# Altium schematic sheet HIVE_BOARD_DECAWAVE.SchDoc
size Tabloid; SheetNumber: 4; SheetTotal: 6; Sheet_Name: DECAWAVE; Size: 11x17
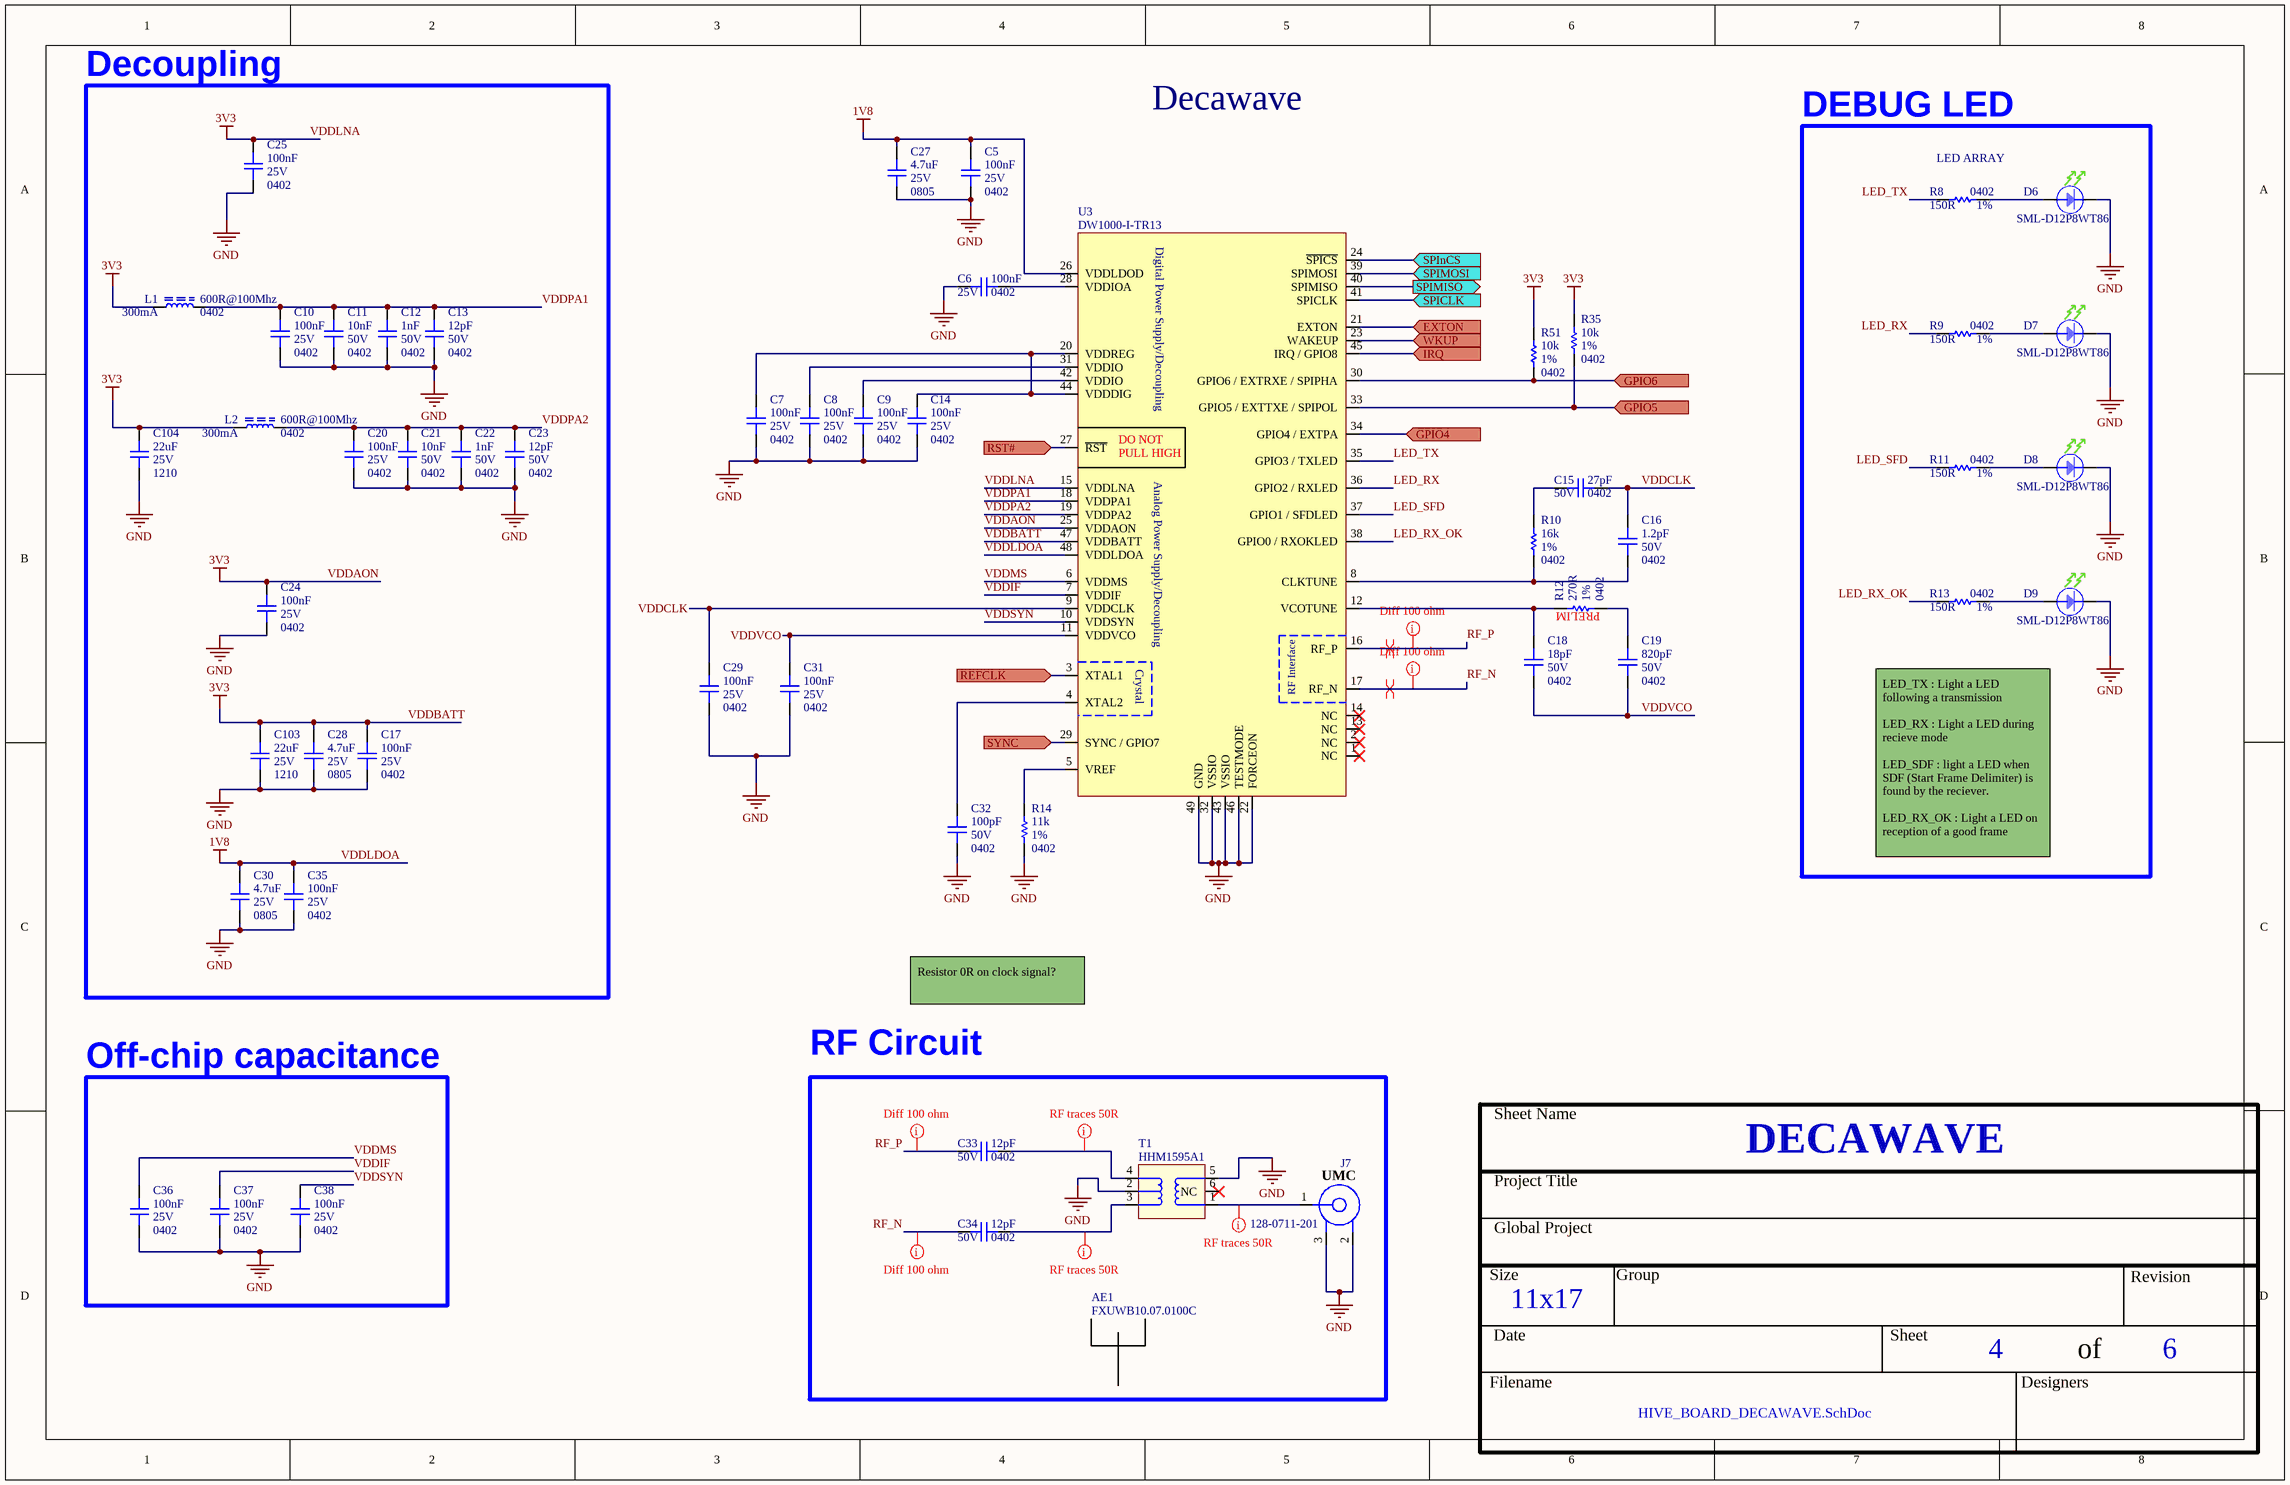
[diagram p0: HIVE_BOARD_DECAWAVE.SchDoc]

## Parts
AE1  FXUWB10.07.0100C  (mechanical)
C5  value 100nF  Package: 0402  Voltage Rating: 25V  [CAP_CER_0402]  (hidden comment: CGA2B3X7R1E104K050BB)
C6  value 100nF  Package: 0402  Voltage Rating: 25V  [CAP_CER_0402]  (hidden comment: CGA2B3X7R1E104K050BB)
C7  value 100nF  Package: 0402  Voltage Rating: 25V  [CAP_CER_0402]  (hidden comment: CGA2B3X7R1E104K050BB)
C8  value 100nF  Package: 0402  Voltage Rating: 25V  [CAP_CER_0402]  (hidden comment: CGA2B3X7R1E104K050BB)
C9  value 100nF  Package: 0402  Voltage Rating: 25V  [CAP_CER_0402]  (hidden comment: CGA2B3X7R1E104K050BB)
C10  value 100nF  Package: 0402  Voltage Rating: 25V  [CAP_CER_0402]  (hidden comment: CGA2B3X7R1E104K050BB)
C11  value 10nF  Package: 0402  Voltage Rating: 50V  [CAP_CER_0402]  (hidden comment: CL05B103KB5NFNC)
C12  value 1nF  Package: 0402  Voltage Rating: 50V  [CAP_CER_0402]  (hidden comment: CC0402KRX7R9BB102)
C13  value 12pF  Package: 0402  Voltage Rating: 50V  [CAP_CER_0402]  (hidden comment: CC0402JRNPO9BN120)
C14  value 100nF  Package: 0402  Voltage Rating: 25V  [CAP_CER_0402]  (hidden comment: CGA2B3X7R1E104K050BB)
C15  value 27pF  Package: 0402  Voltage Rating: 50V  [CAP_CER_0402]  (hidden comment: CC0402JRNPO9BN270)
C16  value 1.2pF  Package: 0402  Voltage Rating: 50V  [CAP_CER_0402]  (hidden comment: C0402C129C5GACTU)
C17  value 100nF  Package: 0402  Voltage Rating: 25V  [CAP_CER_0402]  (hidden comment: CGA2B3X7R1E104K050BB)
C18  value 18pF  Package: 0402  Voltage Rating: 50V  [CAP_CER_0402]  (hidden comment: GRM1555C1H180GA01D)
C19  value 820pF  Package: 0402  Voltage Rating: 50V  [CAP_CER_0402]  (hidden comment: CC0402KRX7R9BB821)
C20  value 100nF  Package: 0402  Voltage Rating: 25V  [CAP_CER_0402]  (hidden comment: CGA2B3X7R1E104K050BB)
C21  value 10nF  Package: 0402  Voltage Rating: 50V  [CAP_CER_0402]  (hidden comment: CL05B103KB5NFNC)
C22  value 1nF  Package: 0402  Voltage Rating: 50V  [CAP_CER_0402]  (hidden comment: CC0402KRX7R9BB102)
C23  value 12pF  Package: 0402  Voltage Rating: 50V  [CAP_CER_0402]  (hidden comment: CC0402JRNPO9BN120)
C24  value 100nF  Package: 0402  Voltage Rating: 25V  [CAP_CER_0402]  (hidden comment: CGA2B3X7R1E104K050BB)
C25  value 100nF  Package: 0402  Voltage Rating: 25V  [CAP_CER_0402]  (hidden comment: CGA2B3X7R1E104K050BB)
C27  value 4.7uF  Package: 0805  Voltage Rating: 25V  [CAP_CER_0805]  (hidden comment: C2012X7R1E475K125AE)
C28  value 4.7uF  Package: 0805  Voltage Rating: 25V  [CAP_CER_0805]  (hidden comment: C2012X7R1E475K125AE)
C29  value 100nF  Package: 0402  Voltage Rating: 25V  [CAP_CER_0402]  (hidden comment: CGA2B3X7R1E104K050BB)
C30  value 4.7uF  Package: 0805  Voltage Rating: 25V  [CAP_CER_0805]  (hidden comment: C2012X7R1E475K125AE)
C31  value 100nF  Package: 0402  Voltage Rating: 25V  [CAP_CER_0402]  (hidden comment: CGA2B3X7R1E104K050BB)
C32  value 100pF  Package: 0402  Voltage Rating: 50V  [CAP_CER_0402]  (hidden comment: CC0402JRNPO9BN101)
C33  value 12pF  Package: 0402  Voltage Rating: 50V  [CAP_CER_0402]  (hidden comment: CC0402JRNPO9BN120)
C34  value 12pF  Package: 0402  Voltage Rating: 50V  [CAP_CER_0402]  (hidden comment: CC0402JRNPO9BN120)
C35  value 100nF  Package: 0402  Voltage Rating: 25V  [CAP_CER_0402]  (hidden comment: CGA2B3X7R1E104K050BB)
C36  value 100nF  Package: 0402  Voltage Rating: 25V  [CAP_CER_0402]  (hidden comment: CGA2B3X7R1E104K050BB)
C37  value 100nF  Package: 0402  Voltage Rating: 25V  [CAP_CER_0402]  (hidden comment: CGA2B3X7R1E104K050BB)
C38  value 100nF  Package: 0402  Voltage Rating: 25V  [CAP_CER_0402]  (hidden comment: CGA2B3X7R1E104K050BB)
C103  value 22uF  Package: 1210  Voltage Rating: 25V  [CAP_CER_1210]  (hidden comment: C3225X7R1E226M250AB)
C104  value 22uF  Package: 1210  Voltage Rating: 25V  [CAP_CER_1210]  (hidden comment: C3225X7R1E226M250AB)
D6  SML-D12P8WT86  [LED_SML-D12P8WT86]
D7  SML-D12P8WT86  [LED_SML-D12P8WT86]
D8  SML-D12P8WT86  [LED_SML-D12P8WT86]
D9  SML-D12P8WT86  [LED_SML-D12P8WT86]
J7  128-0711-201  [CON_UMC_128-0711-201]
L1  value 600R@100Mhz  Current Rating: 300mA  Package: 0402  [FER_0402]  (hidden comment: BLM15AG601SN1D)
L2  value 600R@100Mhz  Current Rating: 300mA  Package: 0402  [FER_0402]  (hidden comment: BLM15AG601SN1D)
R8  value 150R  Tolerance: 1%  Package: 0402  [RES_0402]  (hidden comment: RC0402FR-07150RL)
R9  value 150R  Tolerance: 1%  Package: 0402  [RES_0402]  (hidden comment: RC0402FR-07150RL)
R10  value 16k  Tolerance: 1%  Package: 0402  [RES_0402]  (hidden comment: RC0402FR-0716KL)
R11  value 150R  Tolerance: 1%  Package: 0402  [RES_0402]  (hidden comment: RC0402FR-07150RL)
R12  value 270R  Tolerance: 1%  Package: 0402  [RES_0402]  (hidden comment: RC0402FR-07270RL)
R13  value 150R  Tolerance: 1%  Package: 0402  [RES_0402]  (hidden comment: RC0402FR-07150RL)
R14  value 11k  Tolerance: 1%  Package: 0402  [RES_0402]  (hidden comment: RC0402FR-0711KL)
R35  value 10k  Tolerance: 1%  Package: 0402  [RES_0402]  (hidden comment: RC0402FR-0710KP)
R51  value 10k  Tolerance: 1%  Package: 0402  [RES_0402]  (hidden comment: RC0402FR-0710KP)
T1  HHM1595A1  [XFR_HHM1595A1]
U3  DW1000-I-TR13  [COM_XCV_DW1000-I-TR13]

## Blocks framed on the sheet
Decoupling: C10-C13 C17 C20-C25 C28 C30 C35 C103 C104 L1 L2
DEBUG LED: D6-D9 R8 R9 R11 R13
Off-chip capacitance: C36-C38
RF Circuit: AE1 C33 C34 J7 T1

## Ports
EXTON (in), GPIO4 (in), GPIO5 (in), GPIO6 (in), IRQ (in), REFCLK (in), RST# (in), SPICLK (in), SPIMISO (out), SPIMOSI (in), SPInCS (in), SYNC (in), WKUP (in)

## Nets
GND: C5.1 C6.2 C7.1 C8.1 C9.1 C10.1 C11.1 C12.1 C13.1 C14.1 C17.1 C20.1 C21.1 C22.1 C23.1 C24.1 C25.1 C27.1 C28.1 C29.1 C30.1 C31.1 C32.1 C35.1 C36.1 C37.1 C38.1 C103.1 C104.1 D6.K D7.K D8.K D9.K J7.2 J7.3 R14.1 T1.2(GND) T1.5 U3.22(FORCEON) U3.32(VSSIO) U3.43(VSSIO) U3.46(TESTMODE) U3.49(GND)
VDDAON: C17.2 C24.2 C25.2 C28.2 C103.2 C104.2 L1.1 L2.1 R35.2 R51.2 U3.15(VDDLNA) U3.25(VDDAON) U3.47(VDDBATT)  [also labelled 3V3, VDDBATT, VDDLNA]
VDDLDOA: C5.2 C27.2 C30.2 C35.2 U3.26(VDDLDOD) U3.48(VDDLDOA)  [also labelled 1V8]
EXTON: U3.21(EXTON) ; port EXTON
GPIO4: U3.34(GPIO4_/_EXTPA) ; port GPIO4
GPIO5: R35.1 U3.33(GPIO5_/_EXTTXE_/_SPIPOL) ; port GPIO5
GPIO6: R51.1 U3.30(GPIO6_/_EXTRXE_/_SPIPHA) ; port GPIO6
IRQ: U3.45(IRQ_/_GPIO8) ; port IRQ
LED_RX: R9.2 U3.36(GPIO2_/_RXLED)
LED_RX_OK: R13.2 U3.38(GPIO0_/_RXOKLED)
LED_SFD: R11.2 U3.37(GPIO1_/_SFDLED)
LED_TX: R8.2 U3.35(GPIO3_/_TXLED)
REFCLK: U3.3(XTAL1) ; port REFCLK
RF_N: C34.2 U3.17(RF_N)
RF_P: C33.2 U3.16(RF_P)
RST#: U3.27(~{RST}) ; port RST#
SPICLK: U3.41(SPICLK) ; port SPICLK
SPIMISO: U3.40(SPIMISO) ; port SPIMISO
SPIMOSI: U3.39(SPIMOSI) ; port SPIMOSI
SPInCS: U3.24(~{SPICS}) ; port SPInCS
SYNC: U3.29(SYNC_/_GPIO7) ; port SYNC
VDDCLK: C15.1 C16.2 C29.2 U3.9(VDDCLK)
VDDIF: C37.2 U3.7(VDDIF)
VDDMS: C36.2 U3.6(VDDMS)
VDDPA1: C10.2 C11.2 C12.2 C13.2 L1.2 U3.18(VDDPA1)
VDDPA2: C20.2 C21.2 C22.2 C23.2 L2.2 U3.19(VDDPA2)
VDDSYN: C38.2 U3.10(VDDSYN)
VDDVCO: C18.1 C19.1 C31.2 U3.11(VDDVCO)
WKUP: U3.23(WAKEUP) ; port WKUP
NetC6_1: C6.1 U3.28(VDDIOA)
NetC7_2: C7.2 C14.2 U3.20(VDDREG) U3.44(VDDDIG)
NetC8_2: C8.2 U3.31(VDDIO)
NetC9_2: C9.2 U3.42(VDDIO)
NetC15_2: C15.2 R10.2
NetC16_1: C16.1 R10.1 U3.8(CLKTUNE)
NetC18_2: C18.2 R12.2 U3.12(VCOTUNE)
NetC19_2: C19.2 R12.1
NetC32_2: C32.2 U3.4(XTAL2)
NetC33_1: C33.1 T1.4
NetC34_1: C34.1 T1.3
NetD6_A: D6.A R8.1
NetD7_A: D7.A R9.1
NetD8_A: D8.A R11.1
NetD9_A: D9.A R13.1
NetJ7_1: J7.1 T1.1
NetR14_2: R14.2 U3.5(VREF)

Not connected (* = marked no-connect by the designer): T1 6(NC)*; U3 1(NC)* 2(NC)* 13(NC)* 14(NC)*

## Layout directives
mark named RF traces 50R: NetC33_1, NetC34_1, NetJ7_1
mark named Diff 100 ohm: RF_N, RF_P
differential pair: RF_N, RF_P

## Notes on the sheet
- Decawave
- (near R8) LED ARRAY
- LED_TX : Light a LED following a transmission
  LED_RX : Light a LED during recieve mode
  LED_SDF : light a LED when SDF (Start Frame Delimiter) is found by the reciever.
  LED_RX_OK : Light a LED on reception of a good frame
- Resistor 0R on clock signal?
- Sheet Name
- Project Title
- Global Project
- Size
- Group
- Revision
- Date
- Sheet
- of
- Filename
- Designers
- (in symbol COM_XCV_DW1000-I-TR13) Digital Power Supply/Decoupling; DO NOT; PULL HIGH; Analog Power Supply/Decoupling; Crystal; RF Interface
- (in symbol CON_UMC_128-0711-201) UMC
- (in symbol RES_RC0402FR-07270RL) PRELIM

## Library data of the parts
AE1 = ANT_FXUWB10.07.0100C: External antenna - UWB - UMCC plug; Value: 3.0-10.3GHz; GRAMS Lib Spec: 2.8; HelpURL: http://cdn.taoglas.com/datasheets/FXUWB10.07.0100C.pdf; CreatedBy/Date: Philippe Arsenault; Temperature: -40°C to 85°C; Package: 50 ohm; Assembly Type: UMCC plug; Part Number #1: FXUWB10.07.0100C; Supplier 1: Digi-Key; Supplier Part Number 1: 931-1523-ND
C5-C10 C14 C17 C20 C24 C25 C29 C31 C35-C38 = CAP_CER_CGA2B3X7R1E104K050BB: CAP - CER 0.1µF 10% 25V X7R - 0402; Manufacturer #1: TDK Corporation; GRAMS Lib Spec: 2.8; Magnetic Material: Unknown; Polarized: NO; Assembly Type: SMD; CreatedBy/Date: Nicolas Roy 2018-11-07; Current Rating: *; HelpURL: https://product.tdk.com/info/en/catalog/datasheets/mlcc_automotive_general_en.pdf; Manufacturer #2: *; Note: *; Part Number #1: CGA2B3X7R1E104K050BB; Part Number #2: *; Power Max: *; Temperature: -55°C ~ 125°C; Tolerance: 10%; VerifiedBy: Nicolas V. (2019-01-22); Supplier 1: Digi-Key; Supplier Part Number 1: 445-6902-1-ND; Cryo: UNKNOWN
C11 C21 = CAP_CER_CL05B103KB5NFNC: CAP - CER 10nF ±10% 50V X7R - 0402; Manufacturer #1: Samsung Electro-Mechanics; GRAMS Lib Spec: 2.8; Magnetic Material: Unknown; Polarized: No; Assembly Type: SMD; CreatedBy/Date: Keven Deslandes - 2018/11/20; Current Rating: *; HelpURL: http://www.samsungsem.com/kr/support/product-search/mlcc/CL05B103KB5NFNC.jsp; Manufacturer #2: *; Note: *; Part Number #1: CL05B103KB5NFNC; Part Number #2: *; Power Max: *; Temperature: -55°C ~ 125°C; Tolerance: 10%; VerifiedBy: Nicolas Roy - 2018/12/11; Supplier 1: Digi-Key; Supplier Part Number 1: 1276-1499-1-ND; Cryo: UNKNOWN
C12 C22 = CAP_CER_CC0402KRX7R9BB102: CAP - CER 1nF 10% 50V X7R - 0402; Manufacturer #1: Yageo; GRAMS Lib Spec: 2.8; Magnetic Material: UNKNOWN; Polarized: NO; Assembly Type: SMD; CreatedBy/Date: Jonathan Bouchard 2019-04-06; Current Rating: *; HelpURL: http://www.yageo.com/documents/recent/UPY-GPHC_X7R_6.3V-to-50V_18.pdf; Manufacturer #2: *; Note: *; Part Number #1: CC0402KRX7R9BB102; Part Number #2: *; Power Max: *; Temperature: -55°C ~ 125°C; Tolerance: 10%; VerifiedBy: Nicolas V. (2019-04-30); Supplier 1: Digi-Key; Supplier Part Number 1: 311-1036-1-ND; Cryo: UNKNOWN
C13 C23 C33 C34 = CAP_CER_CC0402JRNPO9BN120: CAP - CER 12pF 50V ±5% C0G, NP0 - 0402; Manufacturer #1: Yageo; GRAMS Lib Spec: 2.8; Magnetic Material: Unknown; Polarized: NO; Assembly Type: SMD; CreatedBy/Date: Philippe Arsenault/ 2020-07-24; Current Rating: *; HelpURL: https://www.yageo.com/upload/media/product/productsearch/datasheet/mlcc/UPY-GP_NP0_16V-to-50V_18.pdf; Manufacturer #2: *; Note: *; Part Number #1: CC0402JRNPO9BN120; Part Number #2: *; Power Max: *; Temperature: -55°C ~ 125°C; Tolerance: ±5%; VerifiedBy: Louis-Daniel Gaulin / 2020-07-29; Cryo: UNKNOWN; Supplier 1: Digi-Key; Supplier Part Number 1: 311-1016-1-ND
C15 = CAP_CER_CC0402JRNPO9BN270: CAP - CER 27pF 50V ±5% C0G, NP0 - 0402; Manufacturer #1: Yageo; GRAMS Lib Spec: 2.8; Magnetic Material: Unknown; Polarized: NO; Assembly Type: SMD; CreatedBy/Date: Philippe Arsenault/ 2020-07-24; Current Rating: *; HelpURL: https://www.yageo.com/upload/media/product/productsearch/datasheet/mlcc/UPY-GP_NP0_16V-to-50V_18.pdf; Manufacturer #2: *; Note: *; Part Number #1: CC0402JRNPO9BN270; Part Number #2: *; Power Max: *; Temperature: -55°C ~ 125°C; Tolerance: ±5%; VerifiedBy: Louis-Daniel Gaulin / 2020-07-29; Cryo: UNKNOWN; Supplier 1: Digi-Key; Supplier Part Number 1: 311-1019-1-ND
C16 = CAP_CER_C0402C129C5GACTU: CAP - CER 1.2pF 50V ±0.25pF C0G, NP0 - 0402; Manufacturer #1: KEMET; GRAMS Lib Spec: 2.8; Magnetic Material: Unknown; Polarized: NO; Assembly Type: SMD; CreatedBy/Date: Philippe Arsenault/ 2020-07-24; Current Rating: *; HelpURL: https://content.kemet.com/datasheets/KEM_C1003_C0G_SMD.pdf; Manufacturer #2: *; Note: *; Part Number #1: C0402C129C5GACTU; Part Number #2: *; Power Max: *; Temperature: -55°C ~ 125°C; Tolerance: ±0.25pF; VerifiedBy: Louis-Daniel Gaulin / 2020-07-29; Cryo: UNKNOWN; Supplier 1: Digi-Key; Supplier Part Number 1: 399-1001-1-ND
C18 = CAP_CER_GRM1555C1H180GA01D: CAP - CER 18pF 50V C0G, NPO - 0402; Manufacturer #1: Murata Electronics North America; Tolerance: 2%; GRAMS Lib Spec: 2.8; Note: Not for new Design; Magnetic Material: UNKNOWN; Polarized: NO; Current Rating: *; Power Max: *; HelpURL: https://psearch.en.murata.com/capacitor/product/GRM1555C1H180GA01%23.html; CreatedBy/Date: Tommy Rossignol / 2018-11-20; VerifiedBy: Caroline Paulin - 13 fév 2019; Temperature: -55°C ~ 125°C; Manufacturer #2: *; Assembly Type: SMD; Part Number #2: *; Part Number #1: GRM1555C1H180GA01D; Supplier 1: Digi-Key; Supplier Part Number 1: 490-6204-1-ND; Cryo: UNKNOWN
C19 = CAP_CER_CC0402KRX7R9BB821: CAP - CER 820pF 50V ±10% X7R - 0402; Manufacturer #1: Yageo; GRAMS Lib Spec: 2.8; Magnetic Material: Unknown; Polarized: NO; Assembly Type: SMD; CreatedBy/Date: Philippe Arsenault/ 2020-07-24; Current Rating: *; HelpURL: https://www.yageo.com/upload/media/product/productsearch/datasheet/mlcc/UPY-GPHC_X7R_6.3V-to-50V_18.pdf; Manufacturer #2: *; Note: *; Part Number #1: CC0402KRX7R9BB821; Part Number #2: *; Power Max: *; Temperature: -55°C ~ 125°C; Tolerance: ±10%; VerifiedBy: Louis-Daniel Gaulin / 2020-07-29; Cryo: UNKNOWN; Supplier 1: Digi-Key; Supplier Part Number 1: 311-1727-1-ND
C27 C28 C30 = CAP_CER_C2012X7R1E475K125AE: CAP - CER 4.7UF 10% 25V X7R - 0805; Manufacturer #1: TDK Corporation; GRAMS Lib Spec: 2.8; Magnetic Material: Unknown; Polarized: No; Tolerance: 10%; Current Rating: *; Power Max: *; HelpURL: https://product.tdk.com/info/en/documents/chara_sheet/C2012X7R1E475K125AE.pdf; CreatedBy/Date: Keven Deslandes - 2018/11/09; VerifiedBy: Nicolas Roy - 2018/12/11; Temperature: -55°C ~ 125°C; Manufacturer #2: *; Note: *; Assembly Type: SMD; Part Number #2: *; Part Number #1: C2012X7R1E475K125AE; Supplier 1: Digi-Key; Supplier Part Number 1: 445-14537-1-ND; Cryo: UNKNOWN
C32 = CAP_CER_CC0402JRNPO9BN101: CAP - CER 100pF 50V ±5% C0G,CP0 - 0402; Manufacturer #1: Yageo; GRAMS Lib Spec: 2.8; Magnetic Material: Unknown; Polarized: NO; Assembly Type: SMD; CreatedBy/Date: Philippe Arsenault/ 2020-07-24; Current Rating: *; HelpURL: https://www.yageo.com/upload/media/product/productsearch/datasheet/mlcc/UPY-GPHC_X7R_6.3V-to-50V_18.pdf; Manufacturer #2: *; Note: *; Part Number #1: CC0402JRNPO9BN101; Part Number #2: *; Power Max: *; Temperature: -55°C ~ 125°C; Tolerance: ±5%; VerifiedBy: Louis-Daniel Gaulin / 2020-07-29; Cryo: UNKNOWN; Supplier 1: Digi-Key; Supplier Part Number 1: 311-1024-1-ND
C103 C104 = CAP_CER_C3225X7R1E226M250AB: CAP - CER 22UF 20% 25V X7R - 1210; Manufacturer #1: TDK Corporation; GRAMS Lib Spec: 2.8; Magnetic Material: Unknown; Polarized: No; Tolerance: 20%; Current Rating: *; Power Max: *; HelpURL: https://product.tdk.com/info/en/documents/chara_sheet/C3225X7R1E226M250AB.pdf; CreatedBy/Date: Nicolas V. (2019-12-11); VerifiedBy: Nicolas V. (2019-12-11); Temperature: -55°C ~ 125°C; Manufacturer #2: *; Note: *; Assembly Type: SMD; Part Number #2: *; Part Number #1: C3225X7R1E226M250AB; Supplier 1: Digi-Key; Supplier Part Number 1: 445-181602-1-ND; Cryo: UNKNOWN
D6-D9 = LED_SML-D12P8WT86: LED - GREEN DIFFUSED 0603 SMD - 0603; Manufacturer #1: Rohm Semiconductor; Current Rating: 1-20mA; Note: Operate at 2mA; Value: 560 nm (green); Voltage rating: 2.2V (Forward), 5V (max Reverse); Polarized: Yes; Magnetic Material: Unknown; GRAMS Lib Spec: 2.8; Manufacturer #2: *; Power Max: *; Part Number #1: SML-D12P8WT86; Part Number #2: *; HelpURL: https://d1d2qsbl8m0m72.cloudfront.net/en/products/databook/datasheet/opto/led/chip_mono/sml-d12x8_d13x8-e.pdf; Supplier 1: Digi-Key; Supplier Part Number 1: 511-1579-2-ND; Assembly Type: SMD; Temperature: -40 ~ 85 °C; Package: 0603; CreatedBy/Date: Keven Deslandes - 2018/11/21; Tolerance: *; VerifiedBy: Caroline Paulin - 13 février 2019; Cryo: UNKNOWN
J7 = CON_UMC_128-0711-201: CON - UMC JACK STR 50 OHM - SMD; Manufacturer #1: Cinch Connectivity Solutions Johnson; Note: Straight; Value: 50 Ohm, 6 GHz; Voltage rating: 200V; Polarized: No; GRAMS Lib Spec: 2.8; Cryo: UNKNOWN; Current Rating: *; Manufacturer #2: *; Power Max: *; Part Number #1: 128-0711-201; Part Number #2: *; HelpURL: https://belfuse.com/resources/cinch-brochures/CCS%20Johnson%20UMC%20Ultra%20Miniature%20Connectors.pdf; Supplier 1: Digi-Key; Supplier Part Number 1: J983CT-ND; Assembly Type: SMD; Magnetic Material: *; Temperature: -40°C ~ 90°C; Package: SMD; CreatedBy/Date: Keven Desandes - 2018/09/27; Tolerance: *; VerifiedBy: Caroline Paulin - 23 janv 2019
L1 L2 = FER_BLM15AG601SN1D: FER - FERRITE BEAD 600 OHM@100MHz - 0402; Manufacturer #1: Murata; GRAMS Lib Spec: 2.8; Magnetic Material: YES; Polarized: NO; Cryo: UNKNOWN; Tolerance: *; Voltage Rating: *; Power Max: *; HelpURL: https://www.murata.com/en-us/products/productdata/8796740059166/ENFA0018.pdf; CreatedBy/Date: Philippe Arsenault/2020-07-24; Temperature: -55°C ~ 125°C; Manufacturer #2: *; Note: *; Assembly Type: SMD; Part Number #2: *; Part Number #1: BLM15AG601SN1D; Supplier 1: Digi-Key; Supplier Part Number 1: 490-1006-1-ND
R8 R9 R11 R13 = RES_RC0402FR-07150RL: RES - 150R 1% 1/16W - 0402; Manufacturer #1: Yageo; GRAMS Lib Spec: 2.8; Magnetic Material: Unknown; Polarized: No; Voltage Rating: 50V; Assembly Type: SMD; CreatedBy/Date: Jonathan Bouchard 2019-03-25; Current Rating: *; HelpURL: http://www.yageo.com/documents/recent/PYu-RC_Group_51_RoHS_L_10.pdf; Manufacturer #2: *; Part Number #1: RC0402FR-07150RL; Part Number #2: *; Power Max: 1/16W; Temperature: -55°C ~ 155°C; VerifiedBy: Nicolas V. (2019-05-02); Supplier 1: Digi-Key; Supplier Part Number 1: 311-150LRCT-ND; Cryo: UNKNOWN
R10 = RES_RC0402FR-0716KL: RES - 16k OHM 1% 1/16W - 0402; Manufacturer #1: Yageo; GRAMS Lib Spec: 2.8; Magnetic Material: Unknown; Polarized: NO; Voltage Rating: 50V; Assembly Type: SMD; CreatedBy/Date: Nicolas Roy/18 oct. 2018; Current Rating: *; HelpURL: http://www.yageo.com/documents/recent/PYu-RC_Group_51_RoHS_L_9.pdf; Manufacturer #2: *; Part Number #1: RC0402FR-0716KL; Part Number #2: *; Power Max: 1/16W; Temperature: -55°C ~ 155°C; VerifiedBy: Caroline Paulin - 18/12/2018; Supplier 1: Digi-Key; Supplier Part Number 1: 311-16.0KLRCT-ND; Cryo: UNKNOWN
R12 = RES_RC0402FR-07270RL: RES - 270 Ohms ±1% 0.063W, 1/16W Chip Resistor 0402  (1005 Metric); Manufacturer #1: Yageo; GRAMS Lib Spec: 2.8c; Magnetic Material: Unknown; Polarized: No; Voltage Rating: 50V; Assembly Type: SMD; CreatedBy/Date: Philippe Arsenault/2021-02-08; Current Rating: *; HelpURL: https://www.yageo.com/upload/media/product/productsearch/datasheet/rchip/PYu-RC_Group_51_RoHS_L_11.pdf; Manufacturer #2: *; Note: *; Part Number #1: RC0402FR-07270RL; Part Number #2: *; Power Max: 1/16W; Temperature: -55°C ~ 155°C; Supplier 1: Digi-Key; Supplier Part Number 1: 311-270LRCT-ND
R14 = RES_RC0402FR-0711KL: RES - 11K 1% 1/16W - 0402; Manufacturer #1: Yageo; GRAMS Lib Spec: 2.8; Magnetic Material: Unknown; Polarized: No; Voltage Rating: 50V; Assembly Type: SMD; CreatedBy/Date: Keven Deslandes 2018-10-15; Current Rating: *; HelpURL: http://www.yageo.com/documents/recent/PYu-RC_Group_51_RoHS_L_9.pdf; Manufacturer #2: *; Part Number #1: RC0402FR-0711KL; Part Number #2: *; Power Max: 1/16W; Temperature: -55°C ~ 155°C; VerifiedBy: Carolilne Paulin - 18/12/2018; Supplier 1: Digi-Key; Supplier Part Number 1: 311-11.0KLRCT-ND; Cryo: UNKNOWN
R35 R51 = RES_RC0402FR-0710KP: RES - 10K OHM 1% 1/16W - 0402; Manufacturer #1: Yageo; GRAMS Lib Spec: 2.8; Magnetic Material: YES; Polarized: NO; Voltage Rating: 50V; Cryo: UNKNOWN; Assembly Type: SMD; CreatedBy/Date: Jonathan Bouchard 2018-07-05; Current Rating: *; HelpURL: http://www.yageo.com/documents/recent/PYu-RC_Group_51_RoHS_L_9.pdf; Manufacturer #2: *; Note: *; Part Number #1: RC0402FR-0710KP; Part Number #2: *; Power Max: 1/16W; Temperature: -55°C ~ 155°C; VerifiedBy: Arnaud Samson 16-07-18; Supplier 1: Digi-Key; Supplier Part Number 1: YAG1249CT-ND
T1 = XFR_HHM1595A1: XFR - Imp Unbalaced/Balanced 50/100 3-8GHz  -SMD; Manufacturer #1: TDK; Value: 3GHz  ~ 8GHz; GRAMS Lib Spec: 2.8; Magnetic Material: Unknown; Polarized: Yes; Tolerance: *; Voltage Rating: *; Current Rating: *; Power Max: *; HelpURL: https://product.tdk.com/info/en/documents/data_sheet/rf_balun_hhm1595a1_en.pdf; CreatedBy/Date: Philippe Arsenault/2020-21-07; VerifiedBy: Louis-Daniel Gaulin / 03-10-2020; Temperature: -40°C ~ 85°C; Package: 0805; Manufacturer #2: *; Note: *; Assembly Type: MT; Part Number #2: *; Part Number #1: HHM1595A1; Supplier 1: Digi-Key; Supplier Part Number 1: 445-3387-1-ND
U3 = COM_XCV_DW1000-I-TR13: COM - IC RF TxRx 802.15.4 IR-UWB DECAWAVE - 48-VFQFN EP; Voltage Rating: 2.8 - 3.6 V; Current Rating: Rx 64mA/Tx 31mA; GRAMS Lib Spec: 2.8; Magnetic Material: Unknown; Polarized: Yes; Cryo: No; Value: *; Tolerance: *; Power Max: *; HelpURL: https://www.decawave.com/sites/default/files/resources/DW1000-Datasheet-V2.12.pdf; CreatedBy/Date: Philippe Arsenault/13-07-2020; Temperature: -40°C ~ 85°C; Package: QFN 48; Manufacturer #1: Decawave; Manufacturer #2: Qorvo; Note: *; Assembly Type: SMT; Part Number #2: *; Part Number #1: DW1000-I-TR13; Supplier 1: Digi-Key; Supplier Part Number 1: 1479-1001-1-ND